# EAGLE design PetitCool_LedShield (EAGLE 7.3.0)
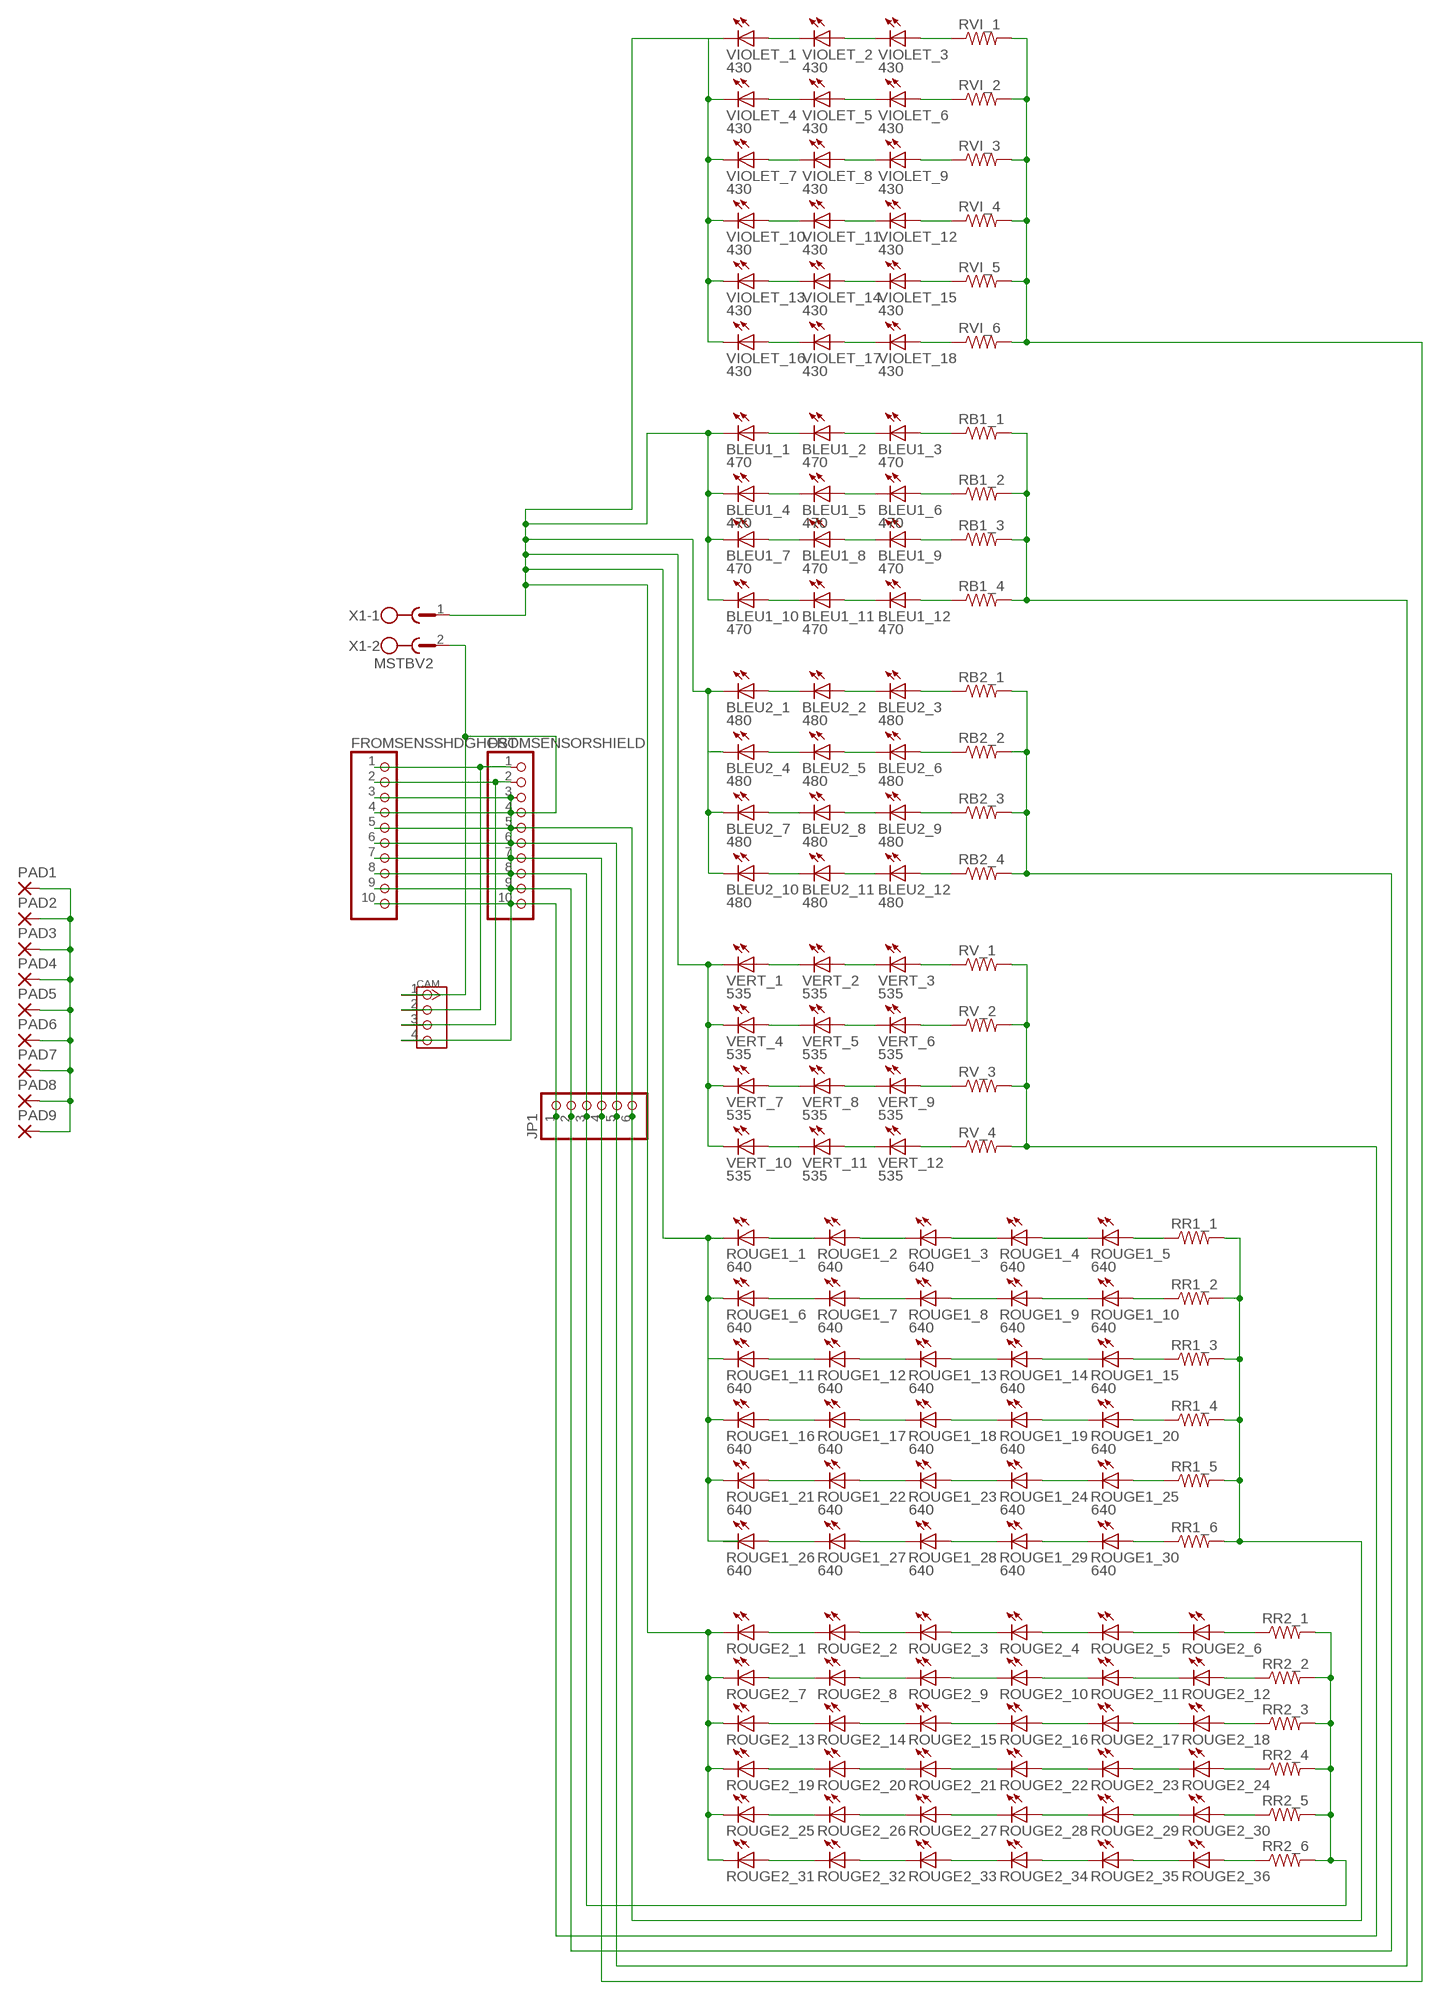
[diagram p0: schematic, sheet 1]

## Parts
BLEU1_1  470  LED5MM  [LED5MM]
BLEU1_2  470  LED5MM  [LED5MM]
BLEU1_3  470  LED5MM  [LED5MM]
BLEU1_4  470  LED5MM  [LED5MM]
BLEU1_5  470  LED5MM  [LED5MM]
BLEU1_6  470  LED5MM  [LED5MM]
BLEU1_7  470  LED5MM  [LED5MM]
BLEU1_8  470  LED5MM  [LED5MM]
BLEU1_9  470  LED5MM  [LED5MM]
BLEU1_10  470  LED5MM  [LED5MM]
BLEU1_11  470  LED5MM  [LED5MM]
BLEU1_12  470  LED5MM  [LED5MM]
BLEU2_1  480  LED5MM  [LED5MM]
BLEU2_2  480  LED5MM  [LED5MM]
BLEU2_3  480  LED5MM  [LED5MM]
BLEU2_4  480  LED5MM  [LED5MM]
BLEU2_5  480  LED5MM  [LED5MM]
BLEU2_6  480  LED5MM  [LED5MM]
BLEU2_7  480  LED5MM  [LED5MM]
BLEU2_8  480  LED5MM  [LED5MM]
BLEU2_9  480  LED5MM  [LED5MM]
BLEU2_10  480  LED5MM  [LED5MM]
BLEU2_11  480  LED5MM  [LED5MM]
BLEU2_12  480  LED5MM  [LED5MM]
CAM  TWIG-4P-2.0-2.0  [4P-2.0]
FROMSENSORSHIELD  PINHD-1X10  [1X10]
FROMSENSSHDGHOST  PINHD-1X10  [1X10]
JP1  PINHD-1X6  [1X06]
PAD1  2,15/1,0  [2,15/1,0]
PAD2  2,15/1,0  [2,15/1,0]
PAD3  2,15/1,0  [2,15/1,0]
PAD4  2,15/1,0  [2,15/1,0]
PAD5  2,15/1,0  [2,15/1,0]
PAD6  2,15/1,0  [2,15/1,0]
PAD7  2,15/1,0  [2,15/1,0]
PAD8  2,15/1,0  [2,15/1,0]
PAD9  2,15/1,0  [2,15/1,0]
RB1_1  R-US_0204/7  [0204/7]
RB1_2  R-US_0204/7  [0204/7]
RB1_3  R-US_0204/7  [0204/7]
RB1_4  R-US_0204/7  [0204/7]
RB2_1  R-US_0204/7  [0204/7]
RB2_2  R-US_0204/7  [0204/7]
RB2_3  R-US_0204/7  [0204/7]
RB2_4  R-US_0204/7  [0204/7]
ROUGE1_1  640  LED5MM  [LED5MM]
ROUGE1_2  640  LED5MM  [LED5MM]
ROUGE1_3  640  LED5MM  [LED5MM]
ROUGE1_4  640  LED5MM  [LED5MM]
ROUGE1_5  640  LED5MM  [LED5MM]
ROUGE1_6  640  LED5MM  [LED5MM]
ROUGE1_7  640  LED5MM  [LED5MM]
ROUGE1_8  640  LED5MM  [LED5MM]
ROUGE1_9  640  LED5MM  [LED5MM]
ROUGE1_10  640  LED5MM  [LED5MM]
ROUGE1_11  640  LED5MM  [LED5MM]
ROUGE1_12  640  LED5MM  [LED5MM]
ROUGE1_13  640  LED5MM  [LED5MM]
ROUGE1_14  640  LED5MM  [LED5MM]
ROUGE1_15  640  LED5MM  [LED5MM]
ROUGE1_16  640  LED5MM  [LED5MM]
ROUGE1_17  640  LED5MM  [LED5MM]
ROUGE1_18  640  LED5MM  [LED5MM]
ROUGE1_19  640  LED5MM  [LED5MM]
ROUGE1_20  640  LED5MM  [LED5MM]
ROUGE1_21  640  LED5MM  [LED5MM]
ROUGE1_22  640  LED5MM  [LED5MM]
ROUGE1_23  640  LED5MM  [LED5MM]
ROUGE1_24  640  LED5MM  [LED5MM]
ROUGE1_25  640  LED5MM  [LED5MM]
ROUGE1_26  640  LED5MM  [LED5MM]
ROUGE1_27  640  LED5MM  [LED5MM]
ROUGE1_28  640  LED5MM  [LED5MM]
ROUGE1_29  640  LED5MM  [LED5MM]
ROUGE1_30  640  LED5MM  [LED5MM]
ROUGE2_1  LED5MM  [LED5MM]
ROUGE2_2  LED5MM  [LED5MM]
ROUGE2_3  LED5MM  [LED5MM]
ROUGE2_4  LED5MM  [LED5MM]
ROUGE2_5  LED5MM  [LED5MM]
ROUGE2_6  LED5MM  [LED5MM]
ROUGE2_7  LED5MM  [LED5MM]
ROUGE2_8  LED5MM  [LED5MM]
ROUGE2_9  LED5MM  [LED5MM]
ROUGE2_10  LED5MM  [LED5MM]
ROUGE2_11  LED5MM  [LED5MM]
ROUGE2_12  LED5MM  [LED5MM]
ROUGE2_13  LED5MM  [LED5MM]
ROUGE2_14  LED5MM  [LED5MM]
ROUGE2_15  LED5MM  [LED5MM]
ROUGE2_16  LED5MM  [LED5MM]
ROUGE2_17  LED5MM  [LED5MM]
ROUGE2_18  LED5MM  [LED5MM]
ROUGE2_19  LED5MM  [LED5MM]
ROUGE2_20  LED5MM  [LED5MM]
ROUGE2_21  LED5MM  [LED5MM]
ROUGE2_22  LED5MM  [LED5MM]
ROUGE2_23  LED5MM  [LED5MM]
ROUGE2_24  LED5MM  [LED5MM]
ROUGE2_25  LED5MM  [LED5MM]
ROUGE2_26  LED5MM  [LED5MM]
ROUGE2_27  LED5MM  [LED5MM]
ROUGE2_28  LED5MM  [LED5MM]
ROUGE2_29  LED5MM  [LED5MM]
ROUGE2_30  LED5MM  [LED5MM]
ROUGE2_31  LED5MM  [LED5MM]
ROUGE2_32  LED5MM  [LED5MM]
ROUGE2_33  LED5MM  [LED5MM]
ROUGE2_34  LED5MM  [LED5MM]
ROUGE2_35  LED5MM  [LED5MM]
ROUGE2_36  LED5MM  [LED5MM]
RR1_1  R-US_0204/7  [0204/7]
RR1_2  R-US_0204/7  [0204/7]
RR1_3  R-US_0204/7  [0204/7]
RR1_4  R-US_0204/7  [0204/7]
RR1_5  R-US_0204/7  [0204/7]
RR1_6  R-US_0204/7  [0204/7]
RR2_1  R-US_0204/7  [0204/7]
RR2_2  R-US_0204/7  [0204/7]
RR2_3  R-US_0204/7  [0204/7]
RR2_4  R-US_0204/7  [0204/7]
RR2_5  R-US_0204/7  [0204/7]
RR2_6  R-US_0204/7  [0204/7]
RV_1  R-US_0204/7  [0204/7]
RV_2  R-US_0204/7  [0204/7]
RV_3  R-US_0204/7  [0204/7]
RV_4  R-US_0204/7  [0204/7]
RVI_1  R-US_0204/7  [0204/7]
RVI_2  R-US_0204/7  [0204/7]
RVI_3  R-US_0204/7  [0204/7]
RVI_4  R-US_0204/7  [0204/7]
RVI_5  R-US_0204/7  [0204/7]
RVI_6  R-US_0204/7  [0204/7]
VERT_1  535  LED5MM  [LED5MM]
VERT_2  535  LED5MM  [LED5MM]
VERT_3  535  LED5MM  [LED5MM]
VERT_4  535  LED5MM  [LED5MM]
VERT_5  535  LED5MM  [LED5MM]
VERT_6  535  LED5MM  [LED5MM]
VERT_7  535  LED5MM  [LED5MM]
VERT_8  535  LED5MM  [LED5MM]
VERT_9  535  LED5MM  [LED5MM]
VERT_10  535  LED5MM  [LED5MM]
VERT_11  535  LED5MM  [LED5MM]
VERT_12  535  LED5MM  [LED5MM]
VIOLET_1  430  LED5MM  [LED5MM]
VIOLET_2  430  LED5MM  [LED5MM]
VIOLET_3  430  LED5MM  [LED5MM]
VIOLET_4  430  LED5MM  [LED5MM]
VIOLET_5  430  LED5MM  [LED5MM]
VIOLET_6  430  LED5MM  [LED5MM]
VIOLET_7  430  LED5MM  [LED5MM]
VIOLET_8  430  LED5MM  [LED5MM]
VIOLET_9  430  LED5MM  [LED5MM]
VIOLET_10  430  LED5MM  [LED5MM]
VIOLET_11  430  LED5MM  [LED5MM]
VIOLET_12  430  LED5MM  [LED5MM]
VIOLET_13  430  LED5MM  [LED5MM]
VIOLET_14  430  LED5MM  [LED5MM]
VIOLET_15  430  LED5MM  [LED5MM]
VIOLET_16  430  LED5MM  [LED5MM]
VIOLET_17  430  LED5MM  [LED5MM]
VIOLET_18  430  LED5MM  [LED5MM]
X1  MSTBV2  [MSTBV2]

## Nets
+5V: CAM.2 FROMSENSORSHIELD.1 FROMSENSSHDGHOST.1
+12V: BLEU1_1.K(C) BLEU1_4.K(C) BLEU1_7.K(C) BLEU1_10.K(C) BLEU2_1.K(C) BLEU2_4.K(C) BLEU2_7.K(C) BLEU2_10.K(C) ROUGE1_1.K(C) ROUGE1_6.K(C) ROUGE1_11.K(C) ROUGE1_16.K(C) ROUGE1_21.K(C) ROUGE2_1.K(C) ROUGE2_7.K(C) ROUGE2_13.K(C) ROUGE2_19.K(C) ROUGE2_25.K(C) ROUGE2_31.K(C) VERT_1.K(C) VERT_4.K(C) VERT_7.K(C) VERT_10.K(C) VIOLET_1.K(C) VIOLET_4.K(C) VIOLET_7.K(C) VIOLET_10.K(C) VIOLET_13.K(C) VIOLET_16.K(C) X1.1
-LED1: FROMSENSORSHIELD.8 FROMSENSSHDGHOST.8 JP1.3 RR2_1.2 RR2_2.2 RR2_3.2 RR2_4.2 RR2_5.2 RR2_6.2
-LED2: FROMSENSORSHIELD.5 FROMSENSSHDGHOST.5 JP1.6 RR1_1.2 RR1_2.2 RR1_3.2 RR1_4.2 RR1_5.2 RR1_6.2
-LED3: FROMSENSORSHIELD.10 FROMSENSSHDGHOST.10 JP1.1 RV_1.2 RV_2.2 RV_3.2 RV_4.2
-LED4: FROMSENSORSHIELD.9 FROMSENSSHDGHOST.9 JP1.2 RB2_1.2 RB2_2.2 RB2_3.2 RB2_4.2
-LED5: FROMSENSORSHIELD.6 FROMSENSSHDGHOST.6 JP1.5 RB1_1.2 RB1_2.2 RB1_3.2 RB1_4.2
-LED6: FROMSENSORSHIELD.7 FROMSENSSHDGHOST.7 JP1.4 RVI_1.2 RVI_2.2 RVI_3.2 RVI_4.2 RVI_5.2 RVI_6.2
CAM_RX: CAM.3 FROMSENSORSHIELD.2 FROMSENSSHDGHOST.2
CAM_TX: CAM.4 FROMSENSORSHIELD.3 FROMSENSSHDGHOST.3
GND_12V: CAM.1 FROMSENSORSHIELD.4 FROMSENSSHDGHOST.4 PAD1.1(P) PAD2.1(P) PAD3.1(P) PAD4.1(P) PAD5.1(P) PAD6.1(P) PAD7.1(P) PAD8.1(P) PAD9.1(P) X1.2
N$12: ROUGE2_1.A ROUGE2_2.K(C)
N$13: ROUGE2_2.A ROUGE2_3.K(C)
N$14: ROUGE2_3.A ROUGE2_4.K(C)
N$15: ROUGE2_4.A ROUGE2_5.K(C)
N$16: ROUGE2_5.A ROUGE2_6.K(C)
N$17: ROUGE2_6.A RR2_1.1
N$18: ROUGE2_7.A ROUGE2_8.K(C)
N$19: ROUGE2_8.A ROUGE2_9.K(C)
N$20: ROUGE2_9.A ROUGE2_10.K(C)
N$21: ROUGE2_10.A ROUGE2_11.K(C)
N$22: ROUGE2_11.A ROUGE2_12.K(C)
N$23: ROUGE2_12.A RR2_2.1
N$24: ROUGE2_13.A ROUGE2_14.K(C)
N$25: ROUGE2_14.A ROUGE2_15.K(C)
N$26: ROUGE2_15.A ROUGE2_16.K(C)
N$27: ROUGE2_16.A ROUGE2_17.K(C)
N$28: ROUGE2_17.A ROUGE2_18.K(C)
N$29: ROUGE2_18.A RR2_3.1
N$30: ROUGE2_19.A ROUGE2_20.K(C)
N$31: ROUGE2_20.A ROUGE2_21.K(C)
N$32: ROUGE2_21.A ROUGE2_22.K(C)
N$33: ROUGE2_22.A ROUGE2_23.K(C)
N$34: ROUGE2_23.A ROUGE2_24.K(C)
N$35: ROUGE2_24.A RR2_4.1
N$36: ROUGE2_25.A ROUGE2_26.K(C)
N$37: ROUGE2_26.A ROUGE2_27.K(C)
N$38: ROUGE2_27.A ROUGE2_28.K(C)
N$39: ROUGE2_28.A ROUGE2_29.K(C)
N$40: ROUGE2_29.A ROUGE2_30.K(C)
N$41: ROUGE2_30.A RR2_5.1
N$42: ROUGE2_31.A ROUGE2_32.K(C)
N$43: ROUGE2_32.A ROUGE2_33.K(C)
N$44: ROUGE2_33.A ROUGE2_34.K(C)
N$45: ROUGE2_34.A ROUGE2_35.K(C)
N$46: ROUGE2_35.A ROUGE2_36.K(C)
N$47: ROUGE2_36.A RR2_6.1
N$48: ROUGE1_26.A ROUGE1_27.K(C)
N$49: ROUGE1_27.A ROUGE1_28.K(C)
N$50: ROUGE1_28.A ROUGE1_29.K(C)
N$51: ROUGE1_29.A ROUGE1_30.K(C)
N$52: ROUGE1_30.A RR1_6.1
N$53: ROUGE1_21.A ROUGE1_22.K(C)
N$54: ROUGE1_22.A ROUGE1_23.K(C)
N$55: ROUGE1_23.A ROUGE1_24.K(C)
N$56: ROUGE1_24.A ROUGE1_25.K(C)
N$57: ROUGE1_25.A RR1_5.1
N$58: ROUGE1_16.A ROUGE1_17.K(C)
N$59: ROUGE1_17.A ROUGE1_18.K(C)
N$60: ROUGE1_18.A ROUGE1_19.K(C)
N$61: ROUGE1_19.A ROUGE1_20.K(C)
N$62: ROUGE1_20.A RR1_4.1
N$63: ROUGE1_11.A ROUGE1_12.K(C)
N$64: ROUGE1_12.A ROUGE1_13.K(C)
N$65: ROUGE1_13.A ROUGE1_14.K(C)
N$66: ROUGE1_14.A ROUGE1_15.K(C)
N$67: ROUGE1_15.A RR1_3.1
N$68: ROUGE1_6.A ROUGE1_7.K(C)
N$69: ROUGE1_7.A ROUGE1_8.K(C)
N$70: ROUGE1_8.A ROUGE1_9.K(C)
N$71: ROUGE1_9.A ROUGE1_10.K(C)
N$72: ROUGE1_10.A RR1_2.1
N$73: ROUGE1_1.A ROUGE1_2.K(C)
N$74: ROUGE1_2.A ROUGE1_3.K(C)
N$75: ROUGE1_3.A ROUGE1_4.K(C)
N$76: ROUGE1_4.A ROUGE1_5.K(C)
N$77: ROUGE1_5.A RR1_1.1
N$78: VERT_10.A VERT_11.K(C)
N$79: VERT_11.A VERT_12.K(C)
N$80: RV_4.1 VERT_12.A
N$81: VERT_7.A VERT_8.K(C)
N$82: VERT_8.A VERT_9.K(C)
N$83: RV_3.1 VERT_9.A
N$84: VERT_4.A VERT_5.K(C)
N$85: VERT_5.A VERT_6.K(C)
N$86: RV_2.1 VERT_6.A
N$87: VERT_1.A VERT_2.K(C)
N$88: VERT_2.A VERT_3.K(C)
N$89: RV_1.1 VERT_3.A
N$90: BLEU2_10.A BLEU2_11.K(C)
N$91: BLEU2_11.A BLEU2_12.K(C)
N$92: BLEU2_12.A RB2_4.1
N$93: BLEU2_7.A BLEU2_8.K(C)
N$94: BLEU2_8.A BLEU2_9.K(C)
N$95: BLEU2_9.A RB2_3.1
N$96: BLEU2_4.A BLEU2_5.K(C)
N$97: BLEU2_5.A BLEU2_6.K(C)
N$98: BLEU2_6.A RB2_2.1
N$99: BLEU2_1.A BLEU2_2.K(C)
N$100: BLEU2_2.A BLEU2_3.K(C)
N$101: BLEU2_3.A RB2_1.1
N$102: BLEU1_10.A BLEU1_11.K(C)
N$103: BLEU1_11.A BLEU1_12.K(C)
N$104: BLEU1_12.A RB1_4.1
N$105: BLEU1_7.A BLEU1_8.K(C)
N$106: BLEU1_8.A BLEU1_9.K(C)
N$107: BLEU1_9.A RB1_3.1
N$108: BLEU1_4.A BLEU1_5.K(C)
N$109: BLEU1_5.A BLEU1_6.K(C)
N$110: BLEU1_6.A RB1_2.1
N$111: BLEU1_1.A BLEU1_2.K(C)
N$112: BLEU1_2.A BLEU1_3.K(C)
N$113: BLEU1_3.A RB1_1.1
N$114: VIOLET_16.A VIOLET_17.K(C)
N$115: VIOLET_17.A VIOLET_18.K(C)
N$116: RVI_6.1 VIOLET_18.A
N$117: VIOLET_13.A VIOLET_14.K(C)
N$118: VIOLET_14.A VIOLET_15.K(C)
N$119: RVI_5.1 VIOLET_15.A
N$120: VIOLET_10.A VIOLET_11.K(C)
N$121: VIOLET_11.A VIOLET_12.K(C)
N$122: RVI_4.1 VIOLET_12.A
N$123: VIOLET_7.A VIOLET_8.K(C)
N$124: VIOLET_8.A VIOLET_9.K(C)
N$125: RVI_3.1 VIOLET_9.A
N$126: VIOLET_4.A VIOLET_5.K(C)
N$127: VIOLET_5.A VIOLET_6.K(C)
N$128: RVI_2.1 VIOLET_6.A
N$129: VIOLET_1.A VIOLET_2.K(C)
N$130: VIOLET_2.A VIOLET_3.K(C)
N$131: RVI_1.1 VIOLET_3.A
Unconnected: ROUGE1_26.K(C)

## Library data of the parts
BLEU1_1-BLEU1_12 BLEU2_1-BLEU2_12 ROUGE1_1-ROUGE1_30 ROUGE2_1-ROUGE2_36 VERT_1-VERT_12 VIOLET_1-VIOLET_18 = led:LED: LED OSRAM: - CHIPLED LG R971, LG N971, LY N971, LG Q971, LY Q971, LO R971, LY R971 LH N974, LH R974 LS Q976, LO Q976, LY Q976 LO Q996 - Hyper CHIPLED LW Q18S LB Q993, LB Q99A, LB R99A - SideLED LS A670, LO A670, LY A670, LG A670, LP A670 LB A673, LV A673, LT A673, LW A673 LH A674 LY A675 LS A676, LA A676, LO A676, LY A676, LW A676 LS A679, LY A679, LG A679 - Hyper Micro SIDELED® LS Y876, LA Y876, LO Y876, LY Y876 LT Y87S - SmartLED LW L88C, LW L88S LB L89C, LB L89S, LG L890 LS L89K, LO L89K, LY L89K LS L896, LA L896, LO L896, LY L896 - TOPLED LS T670, LO T670, LY T670, LG T670, LP T670 LSG T670, LSP T670, LSY T670, LOP T670, LYG T670 LG T671, LOG T671, LSG T671 LB T673, LV T673, LT T673, LW T673 LH T674 LS T676, LA T676, LO T676, LY T676, LB T676, LH T676, LSB T676, LW T676 LB T67C, LV T67C, LT T67C, LS T67K, LO T67K, LY T67K, LW E67C LS E67B, LA E67B, LO E67B, LY E67B, LB E67C, LV E67C, LT E67C LW T67C LS T679, LY T679, LG T679 LS T770, LO T770, LY T770, LG T770, LP T770 LB T773, LV T773, LT T773, LW T773 LH T774 LS E675, LA E675, LY E675, LS T675 LS T776, LA T776, LO T776, LY T776, LB T776 LHGB T686 LT T68C, LB T68C - Hyper Mini TOPLED® LB M676 - Mini TOPLED Santana® LG M470 LS M47K, LO M47K, LY M47K Source: http://www.osram.convergy.de LUXEON: - LUMILED® LXK2-PW12-R00, LXK2-PW12-S00, LXK2-PW14-U00, LXK2-PW14-V00 LXK2-PM12-R00, LXK2-PM12-S00, LXK2-PM14-U00 LXK2-PE12-Q00, LXK2-PE12-R00, LXK2-PE12-S00, LXK2-PE14-T00, LXK2-PE14-U00 LXK2-PB12-K00, LXK2-PB12-L00, LXK2-PB12-M00, LXK2-PB14-N00, LXK2-PB14-P00, LXK2-PB14-Q00 LXK2-PR12-L00, LXK2-PR12-M00, LXK2-PR14-Q00, LXK2-PR14-R00 LXK2-PD12-Q00, LXK2-PD12-R00, LXK2-PD12-S00 LXK2-PH12-R00, LXK2-PH12-S00 LXK2-PL12-P00, LXK2-PL12-Q00, LXK2-PL12-R00 Source: www.luxeon.com KINGBRIGHT: KA-3528ASYC Source: www.kingbright.com
CAM = Connector:TWIG-4P-2.0
FROMSENSORSHIELD FROMSENSSHDGHOST = pinhead:PINHD-1X10: PIN HEADER
JP1 = pinhead:PINHD-1X6: PIN HEADER
PAD1-PAD9 = wirepad:2,15/1,0: THROUGH-HOLE PAD
RB1_1-RB1_4 RB2_1-RB2_4 RR1_1-RR1_6 RR2_1-RR2_6 RV_1-RV_4 RVI_1-RVI_6 = rcl:R-US_: RESISTOR, American symbol
X1 = con-phoenix-508:MSTBV2: PHOENIX; MPN: MSTBV 2,5/2-GF-5.08; OC_FARNELL: 1792792; OC_NEWARK: 69R9845

## Board
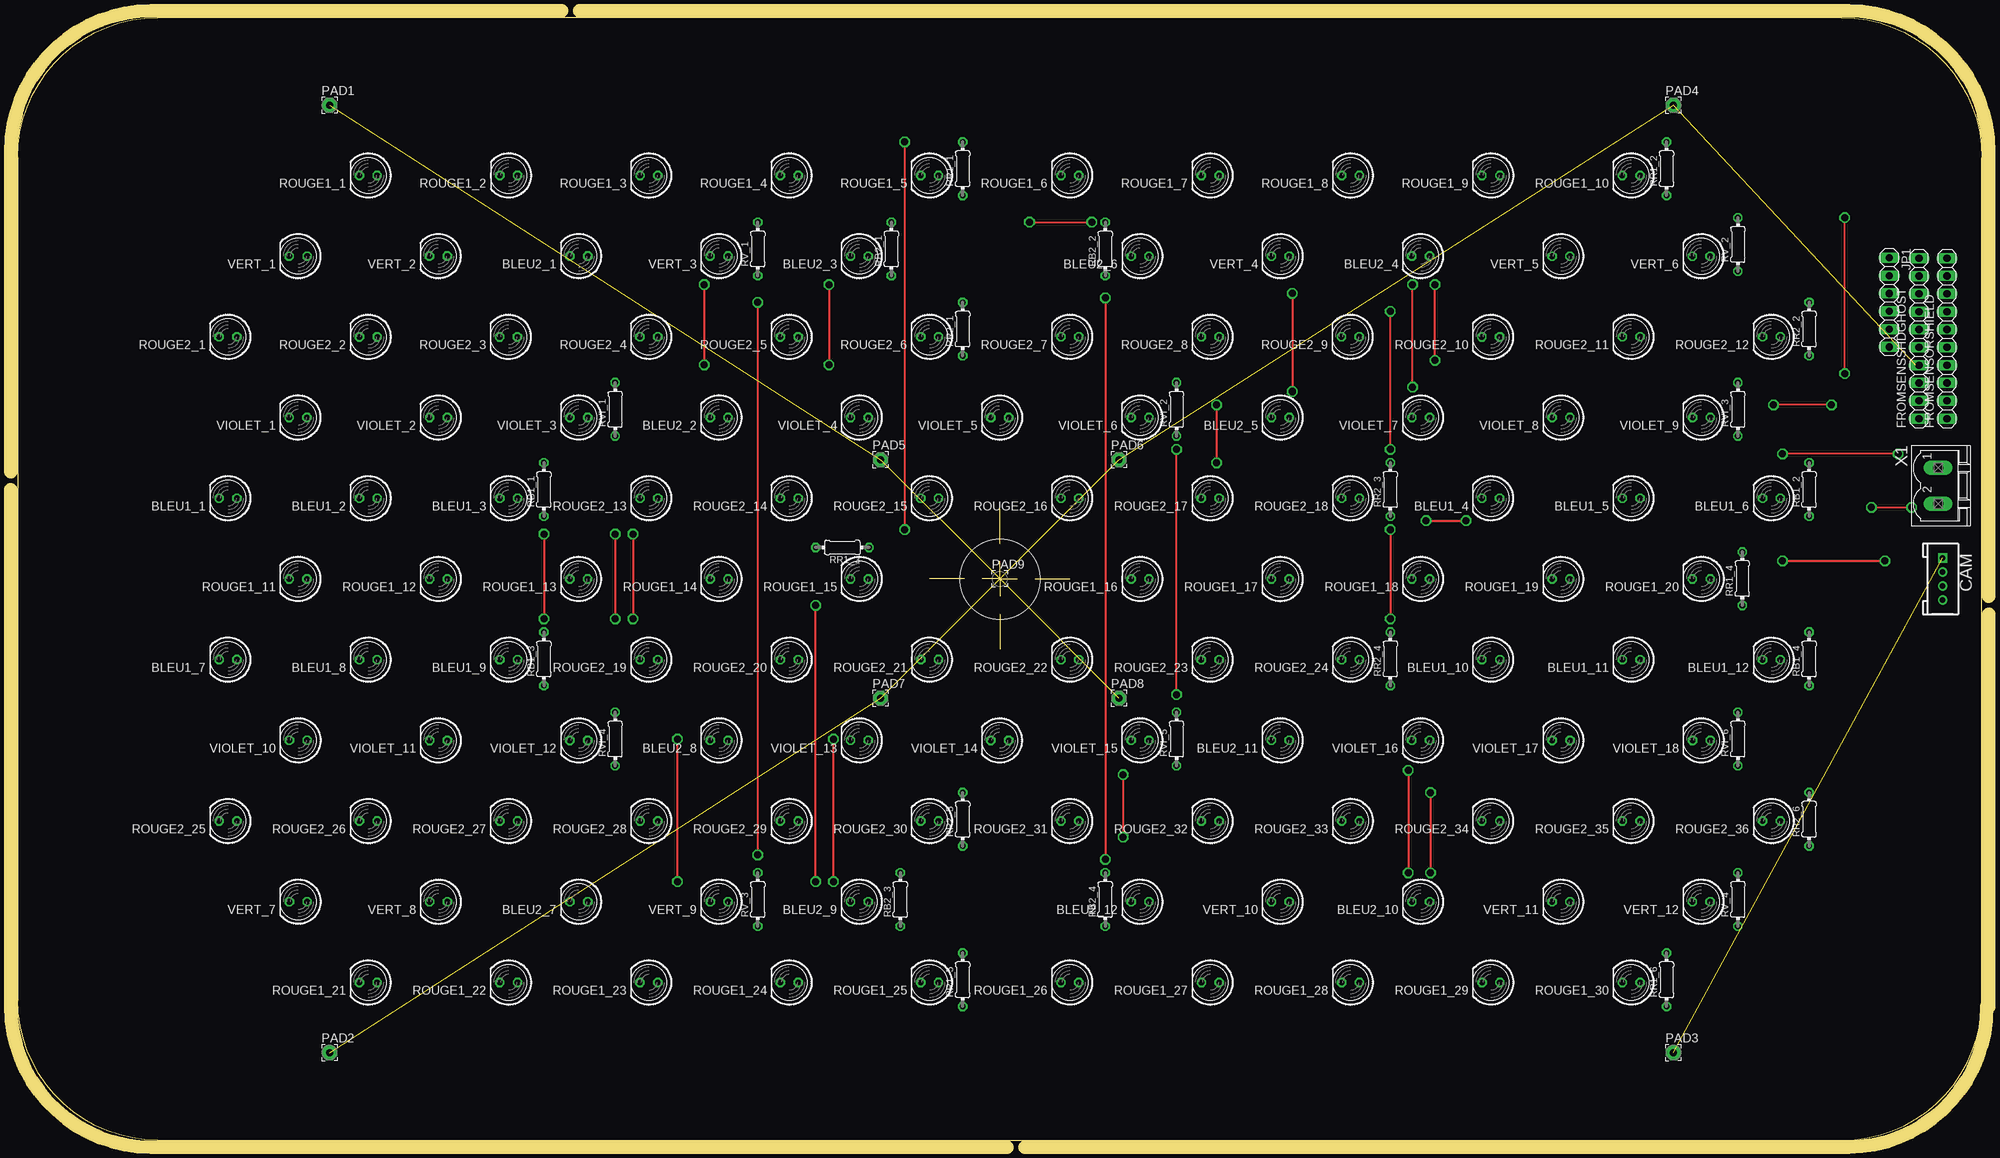
[diagram p1: board, top side]
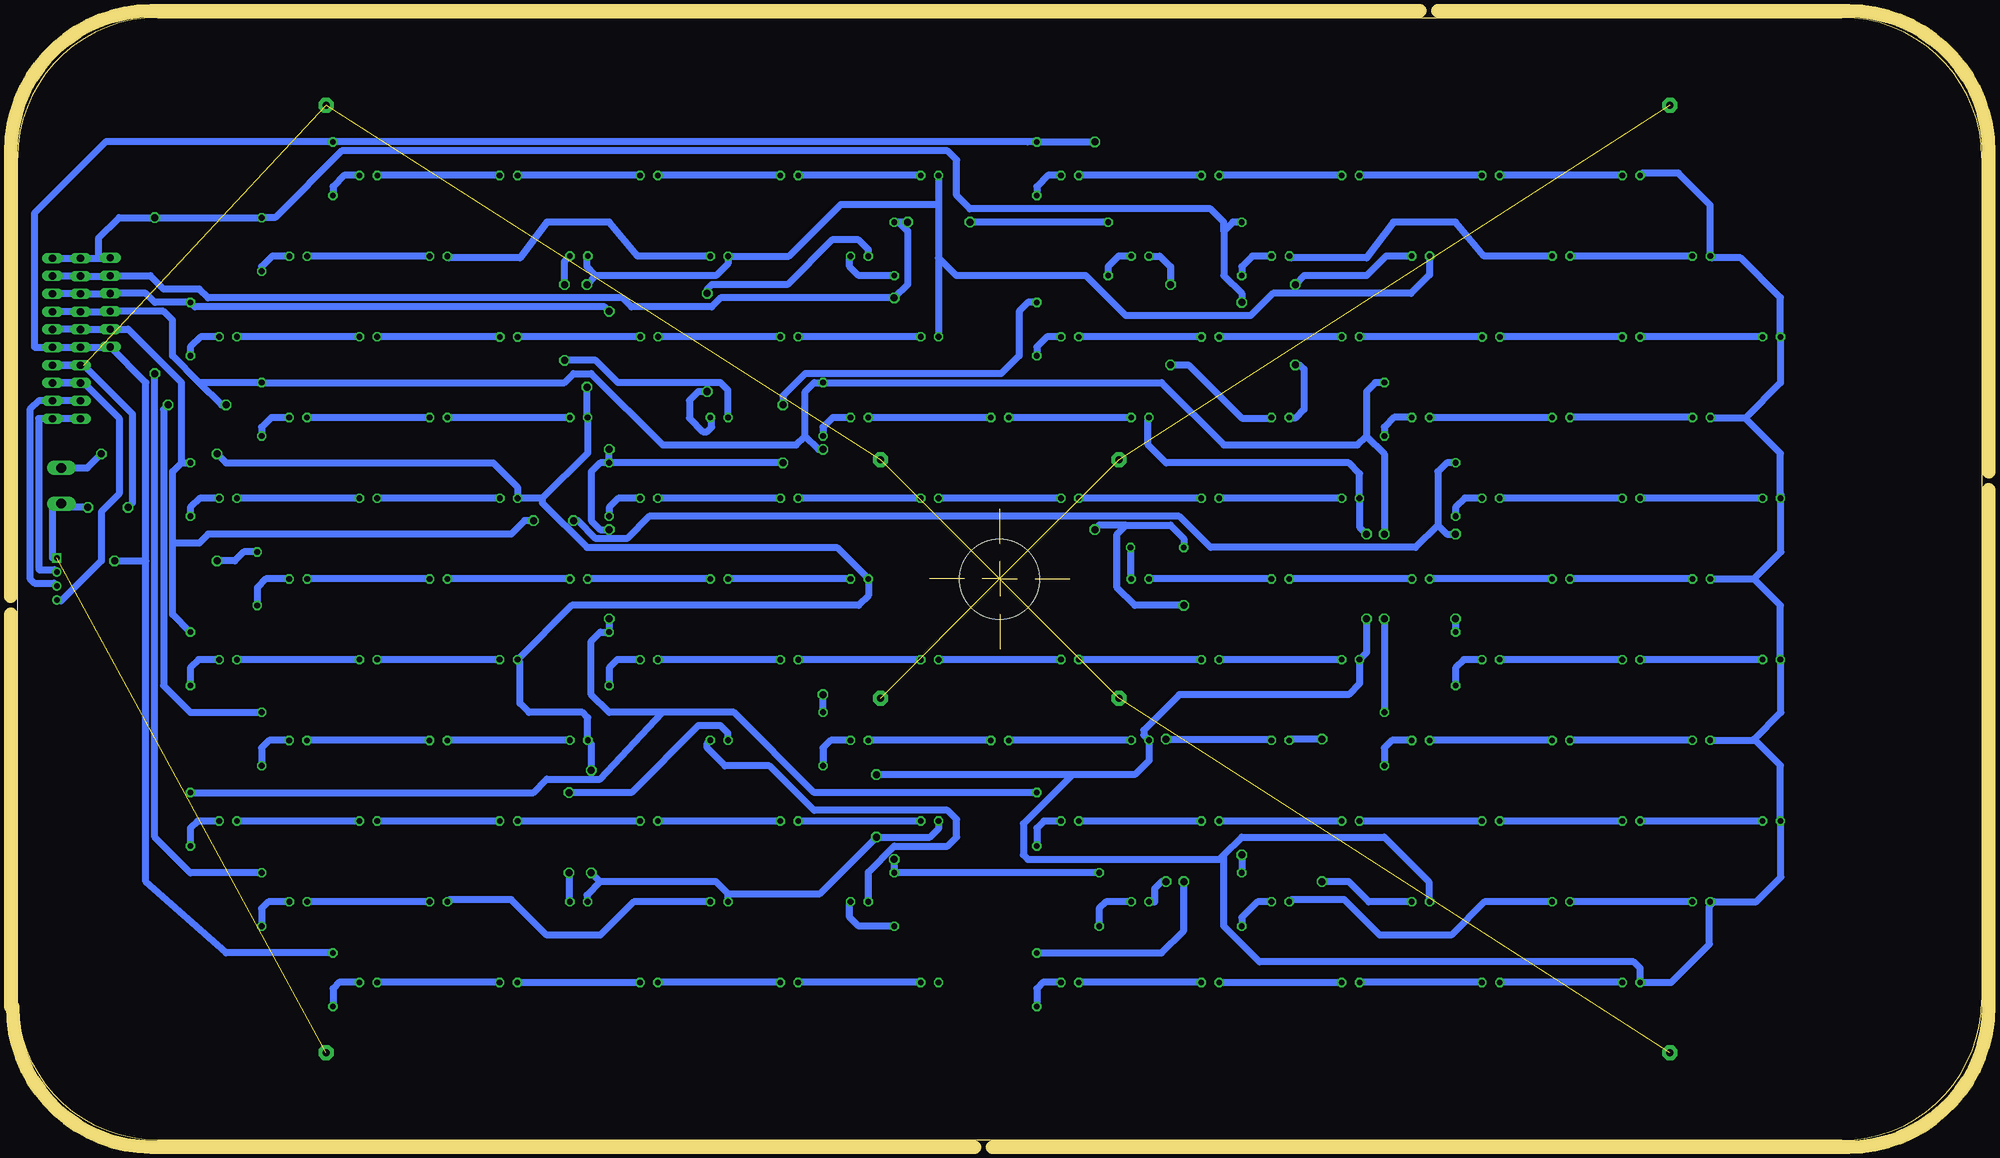
[diagram p2: board, bottom side, seen from below]

Size 280 x 160 mm. Coordinates in mm from the lower left corner, seen from the top.
Outline: 0,20 0,140 arc-90 20,160 260,160 arc-90 280,140 280,20 arc-90 260,0 20,0 arc-90 0.05,20
Outline: 140,80 140,82.5
Outline: 140,80 137.5,80
Outline: 140,80 140,77.5
Outline: 140,80 142.5,80
Outline: 140,85 140,90
Outline: 135,80 130,80
Outline: 140,75 140,70
Outline: 145,80 150,80
Copper layers (1*16): Top 0.035mm / dielectric 1.5mm / Bottom 0.035mm
Design rules "default": minimum track width 10mil, minimum drill 24mil, track to track 8mil, track to pad 8mil, pad to pad 8mil, via to via 8mil, smd to smd 8mil, copper to edge 40mil, drill to drill 8mil, minimum pad ring 10mil, minimum via ring 8mil, stop-mask expansion 4mil, vias tented up to drill 0mil, thermal gap 10mil
Holes 11.43 mm at 140,79.99
Milling: 12 lines

### Footprints (pad centres in the part's own frame; a part is rotated, then mirrored left to right if it is on the bottom)
LED5MM = drill 0.813 octagon: A -1.27,0; K 1.27,0
4P-2.0 = drill 0.8 pad 1.27 square: 1 -3,0 | drill 0.8 pad 1.27: 2 -1,0; 3 1,0; 4 3,0
1X10 = drill 1.016 long: 1 -11.43,0; 2 -8.89,0; 3 -6.35,0; 4 -3.81,0; 5 -1.27,0; 6 1.27,0; 7 3.81,0; 8 6.35,0; 9 8.89,0; 10 11.43,0
1X06 = drill 1.016 long: 1 -6.35,0; 2 -3.81,0; 3 -1.27,0; 4 1.27,0; 5 3.81,0; 6 6.35,0
2,15/1,0 = drill 1.016 pad 2.159 octagon: 1 0,0
0204/7 = drill 0.813 octagon: 1 -3.81,0; 2 3.81,0
MSTBV2 = drill 1.397 long: 1 -2.54,0; 2 2.54,0

### Placement (x,y rotation side)
BLEU1_1  30,91.5 180 top
BLEU1_2  50,91.5 180 top
BLEU1_3  70,91.5 180 top
BLEU1_4  209.99,91.5 180 top
BLEU1_5  230,91.5 180 top
BLEU1_6  250,91.5 180 top
BLEU1_7  30,68.5 180 top
BLEU1_8  50,68.5 180 top
BLEU1_9  70,68.5 180 top
BLEU1_10  210,68.5 180 top
BLEU1_11  230,68.5 180 top
BLEU1_12  250,68.49 180 top
BLEU2_1  80,126.01 180 top
BLEU2_2  100,103 180 top
BLEU2_3  120,126 180 top
BLEU2_4  200,126 180 top
BLEU2_5  180,103 180 top
BLEU2_6  160,125.99 180 top
BLEU2_7  80,34 180 top
BLEU2_8  100,57 180 top
BLEU2_9  120,34 180 top
BLEU2_10  200,34 180 top
BLEU2_11  180,57 180 top
BLEU2_12  160.01,34 180 top
CAM  274.39,79.99 270 top
FROMSENSORSHIELD  275.03,114.28 90 top
FROMSENSSHDGHOST  271.03,114.28 90 top
JP1  266.8,119.41 270 top
PAD1  44.47,147.5 0 top
PAD2  44.47,12.5 0 top
PAD3  236.03,12.5 0 top
PAD4  236.03,147.5 0 top
PAD5  123,97 0 top
PAD6  157,97 0 top
PAD7  123,63 0 top
PAD8  157,63 0 top
PAD9  140,80 0 top
RB1_1  75.03,92.74 90 top
RB1_2  255.37,92.74 90 top
RB1_3  75.03,68.61 90 top
RB1_4  255.37,68.61 90 top
RB2_1  124.56,127.03 90 top
RB2_2  155.04,127.03 90 top
RB2_3  125.83,34.32 90 top
RB2_4  155.04,34.32 90 top
ROUGE1_1  50,137.5 180 top
ROUGE1_2  70.01,137.51 180 top
ROUGE1_3  90,137.49 180 top
ROUGE1_4  110,137.5 180 top
ROUGE1_5  130,137.5 180 top
ROUGE1_6  150,137.5 180 top
ROUGE1_7  170,137.5 180 top
ROUGE1_8  190.01,137.49 180 top
ROUGE1_9  210,137.5 180 top
ROUGE1_10  230,137.5 180 top
ROUGE1_11  39.99,80 180 top
ROUGE1_12  60,80 180 top
ROUGE1_13  79.99,80 180 top
ROUGE1_14  100,80 180 top
ROUGE1_15  120,80 180 top
ROUGE1_16  160,80 180 top
ROUGE1_17  179.99,79.99 180 top
ROUGE1_18  200.01,80 180 top
ROUGE1_19  220,80 180 top
ROUGE1_20  240,80 180 top
ROUGE1_21  50,22.49 180 top
ROUGE1_22  70,22.5 180 top
ROUGE1_23  89.98,22.49 180 top
ROUGE1_24  110,22.5 180 top
ROUGE1_25  130,22.5 180 top
ROUGE1_26  150.01,22.5 180 top
ROUGE1_27  170.01,22.5 180 top
ROUGE1_28  190,22.49 180 top
ROUGE1_29  210.01,22.5 180 top
ROUGE1_30  230.01,22.5 180 top
ROUGE2_1  29.99,114.5 180 top
ROUGE2_2  50,114.5 180 top
ROUGE2_3  69.98,114.5 180 top
ROUGE2_4  89.99,114.5 180 top
ROUGE2_5  110,114.49 180 top
ROUGE2_6  129.99,114.5 180 top
ROUGE2_7  150.01,114.5 180 top
ROUGE2_8  170,114.5 180 top
ROUGE2_9  189.98,114.51 180 top
ROUGE2_10  210,114.49 180 top
ROUGE2_11  230,114.5 180 top
ROUGE2_12  250,114.5 180 top
ROUGE2_13  90,91.5 180 top
ROUGE2_14  110,91.5 180 top
ROUGE2_15  130,91.5 180 top
ROUGE2_16  150,91.5 180 top
ROUGE2_17  170,91.5 180 top
ROUGE2_18  190,91.5 180 top
ROUGE2_19  90,68.5 180 top
ROUGE2_20  110,68.5 180 top
ROUGE2_21  130,68.5 180 top
ROUGE2_22  150,68.5 180 top
ROUGE2_23  170,68.49 180 top
ROUGE2_24  190,68.5 180 top
ROUGE2_25  30,45.5 180 top
ROUGE2_26  50,45.5 180 top
ROUGE2_27  70,45.5 180 top
ROUGE2_28  90,45.5 180 top
ROUGE2_29  110,45.5 180 top
ROUGE2_30  130,45.5 180 top
ROUGE2_31  150,45.5 180 top
ROUGE2_32  170,45.49 180 top
ROUGE2_33  190,45.5 180 top
ROUGE2_34  210,45.5 180 top
ROUGE2_35  230,45.5 180 top
ROUGE2_36  250,45.5 180 top
RR1_1  134.72,138.46 90 top
RR1_2  235.05,138.46 90 top
RR1_3  117.57,84.49 180 top
RR1_4  245.84,80.04 90 top
RR1_5  134.72,22.89 90 top
RR1_6  235.05,22.89 90 top
RR2_1  134.72,115.6 90 top
RR2_2  255.37,115.6 90 top
RR2_3  195.68,92.74 90 top
RR2_4  195.68,68.61 90 top
RR2_5  134.72,45.75 90 top
RR2_6  255.37,45.75 90 top
RV_1  105.51,127.03 90 top
RV_2  245.21,127.67 90 top
RV_3  105.51,34.32 90 top
RV_4  245.21,34.32 90 top
RVI_1  85.19,104.17 90 top
RVI_2  165.2,104.17 90 top
RVI_3  245.21,104.17 90 top
RVI_4  85.19,57.18 90 top
RVI_5  165.2,57.18 90 top
RVI_6  245.21,57.18 90 top
VERT_1  40,126 180 top
VERT_2  59.98,126 180 top
VERT_3  99.99,126 180 top
VERT_4  180,126 180 top
VERT_5  220,126 180 top
VERT_6  239.99,126 180 top
VERT_7  40.01,34.01 180 top
VERT_8  60,33.99 180 top
VERT_9  100,34 180 top
VERT_10  180,34 180 top
VERT_11  220,34 180 top
VERT_12  239.99,34 180 top
VIOLET_1  39.99,103.01 180 top
VIOLET_2  59.99,103 180 top
VIOLET_3  80,103.01 180 top
VIOLET_4  120.01,103 180 top
VIOLET_5  140,102.99 180 top
VIOLET_6  159.99,103 180 top
VIOLET_7  200,103 180 top
VIOLET_8  220,103 180 top
VIOLET_9  240.01,103 180 top
VIOLET_10  40.01,57 180 top
VIOLET_11  60,57 180 top
VIOLET_12  80,56.99 180 top
VIOLET_13  120,57 180 top
VIOLET_14  140,56.99 180 top
VIOLET_15  160,57 180 top
VIOLET_16  200,57 180 top
VIOLET_17  220.01,57 180 top
VIOLET_18  240,57 180 top
X1  273.75,93.28 270 top

### Tracks (layer width: path | path; a pad name or v marks a point on that pad's centre or on a via)
+5V
  Bottom 1.016: FROMSENSSHDGHOST.1 FROMSENSORSHIELD.1 277.01,102.85 276.96,101.63 276.96,81.31 274.71,81.31 CAM.2
+12V  (via drill 1)
  Top 0.254: v87.73,86.39 v87.73,74.33 | v198.85,107.35 v198.85,121.95 | v198.22,52.74 v198.22,38.13 | v157.58,52.1 v157.58,43.21 | v268.07,97.82 v251.56,97.82
  Bottom 1.016: ROUGE1_1.K 48.4,137.83 43.28,137.83 38.73,133.28 VERT_1.K 38.49,125.76 34.39,125.76 28.72,120.1 ROUGE2_1.K 28.72,107.93 33.75,102.9 | 33.75,102.9 38.62,102.9 VIOLET_1.K | BLEU1_1.K 28.73,92.11 | 28.73,92.11 28.73,97.88 33.75,102.9 | ROUGE1_11.K 32.52,80 | 32.52,80 28.67,83.85 28.67,92.05 28.73,92.11 | 32.52,80 28.73,76.22 BLEU1_7.K 28.67,68.44 28.67,60.99 32.48,57.18 | VIOLET_10.K 32.66,57 32.48,57.18 | 32.48,57.18 28.73,53.43 ROUGE2_25.K 28.67,45.44 28.67,37.5 32.16,34.01 38.2,34.01 | VERT_7.K 38.2,34.01 | 38.2,34.01 38.83,33.38 38.83,27.97 44.31,22.49 ROUGE1_21.K 48.73,24.53 49.63,25.43 102.97,25.43 108.05,30.51 108.05,40.67 | VIOLET_4.K 118.84,102.9 118.84,99.09 116.3,96.55 90.27,96.55 88.73,95.01 ROUGE2_13.K 88.73,87.39 v87.73,86.39 | ROUGE1_6.K 148.73,133.38 | 148.73,133.38 148.73,125.76 | 148.73,125.76 ROUGE2_7.K | 148.73,133.38 162.66,133.38 170.04,126 VERT_4.K 178.73,124.93 180.44,123.22 197.58,123.22 | 205.2,91.47 198.73,97.94 VIOLET_7.K 198.85,103.12 v198.85,107.35 | 205.2,91.47 208.7,91.47 BLEU1_4.K 208.72,93.09 212.19,96.55 250.29,96.55 v251.56,97.82 | 197.58,123.22 198.85,124.49 198.85,125.88 BLEU2_4.K | v87.73,74.33 87.73,69.5 ROUGE2_19.K 88.73,65.07 90.27,63.53 114.4,63.53 119.48,58.45 119.48,57.75 VIOLET_13.K 118.73,54.12 120.75,52.1 129.64,52.1 | v198.85,121.95 197.58,123.22 | VERT_10.K 178.73,35.15 | 178.73,35.15 180.44,36.86 196.95,36.86 | 196.95,36.86 198.85,34.96 198.85,34.12 BLEU2_10.K | v198.22,52.74 198.22,56.49 VIOLET_16.K 198.73,60.23 199.49,60.99 207.11,60.99 208.38,62.26 208.38,68.15 BLEU1_10.K 201,76.23 160.12,76.23 158.73,77.62 ROUGE1_16.K 163.21,84.49 198.85,84.49 205.2,90.84 205.2,91.47
  Bottom 1.016: v198.22,38.13 196.95,36.86 | 129.64,52.1 v157.58,52.1 | ROUGE2_31.K 148.69,45.46 148.69,44.48 149.96,43.21 v157.58,43.21 165.64,35.15 178.73,35.15 | 108.05,40.67 105.51,43.21 85.19,43.21 78.84,36.86 78.84,34.1 BLEU2_7.K | 129.64,52.1 136.62,45.12 136.62,40.67 135.99,40.04 108.68,40.04 108.05,40.67 | BLEU2_1.K 78.73,123.33 81.38,120.68 101.06,120.68 104.24,117.51 122.02,117.51 127.73,123.22 146.19,123.22 148.73,125.76 | v268.07,97.82 270.06,95.82 X1.1
-LED1  (via drill 1)
  Top 0.254: v195.68,87.03 v195.68,74.33 | v170.91,104.81 v170.91,96.55 | v195.68,98.46 v195.68,118.14
  Bottom 1.016: RR2_3.2 196.95,96.55 198.22,95.28 198.22,88.3 196.95,87.03 v195.68,87.03 | v195.68,74.33 RR2_4.2 196.95,72.42 198.22,71.15 198.22,63.53 195.68,60.99 188.06,60.99 | RR2_5.2 166.47,49.56 177.9,60.99 188.06,60.99 | RR2_6.2 206.47,49.56 204.57,51.47 196.95,51.47 188.06,60.99 | RR2_1.2 135.99,119.41 137.26,118.14 137.26,111.79 139.8,109.25 167.74,109.25 170.91,106.08 v170.91,104.81 | v170.91,96.55 RR2_3.2 | RR2_3.2 v195.68,98.46 | v195.68,118.14 196.31,118.78 254.73,118.78 RR2_2.2 260.45,119.41 261.72,120.68 JP1.3 266.85,120.63 FROMSENSSHDGHOST.8 | FROMSENSSHDGHOST.8 | FROMSENSSHDGHOST.8 FROMSENSORSHIELD.8
-LED2  (via drill 1)
  Top 0.254: v113.76,36.86 v113.76,76.23 | v126.46,142.27 v126.46,87.03 | v251.56,82.58 v266.16,82.58
  Bottom 1.016: RR1_1.2 RR1_2.2 267.43,142.27 277.59,132.11 277.59,113.04 FROMSENSORSHIELD.5 FROMSENSSHDGHOST.5 266.85,113.01 JP1.6 261.72,107.98 261.72,82.58 | RR1_5.2 116.94,26.7 113.76,29.88 v113.76,36.86 | v113.76,76.23 120.75,76.23 123.29,78.77 123.29,86.39 122.02,87.66 | 122.02,87.66 115.67,87.66 113.76,85.76 RR1_3.2 | RR1_1.2 135.99,142.27 | RR1_1.2 v126.46,142.27 | 122.02,87.66 125.83,87.66 v126.46,87.03 | RR1_6.2 250.29,26.7 261.72,36.86 261.72,82.58 | RR1_4.2 247.75,83.85 249.02,82.58 v251.56,82.58 | v266.16,82.58 261.72,82.58
-LED3  (via drill 1)
  Top 0.254: v105.51,119.41 v105.51,40.67 | v260.45,109.25 v260.45,131.48
  Bottom 1.016: RV_1.2 106.78,130.84 108.05,129.57 | 108.05,129.57 108.05,123.22 105.51,120.68 v105.51,119.41 | v105.51,40.67 RV_3.2 | RV_4.2 255.37,38.13 260.45,43.21 v260.45,109.25 | 108.05,129.57 108.05,130.84 109.95,132.75 144.24,132.75 146.15,134.65 146.15,139.73 147.42,141 233.78,141 243.3,131.48 RV_2.2 v260.45,131.48 265.53,131.48 268.49,128.52 268.49,126.13 268.07,125.71 | FROMSENSORSHIELD.10 FROMSENSSHDGHOST.10 268.07,125.71 | 268.07,125.71 266.85,125.71 JP1.1
-LED4  (via drill 1)
  Top 0.254: v144.24,130.84 v153.13,130.84 | v155.04,120.05 v155.04,40.04
  Bottom 1.016: RB2_3.2 RB2_4.2 v155.04,40.04 | RB2_1.2 v144.24,130.84 | v153.13,130.84 RB2_2.2 154.4,130.84 153.13,129.57 153.13,121.95 v155.04,120.05 179.8,120.05 181.07,118.78 192.5,118.78 193.77,120.05 252.83,120.05 254.1,121.32 259.18,121.32 261.08,123.22 JP1.2 266.85,123.17 FROMSENSSHDGHOST.9 FROMSENSORSHIELD.9
-LED5  (via drill 1)
  Top 0.254: v75.03,86.39 v75.03,74.33 | v200.76,88.3 v206.47,88.3
  Bottom 1.016: RB1_1.2 76.3,96.55 77.57,95.28 77.57,87.66 | 77.57,87.66 76.3,86.39 v75.03,86.39 | v75.03,74.33 RB1_3.2 | RB1_4.2 257.91,74.96 257.91,85.12 | 257.91,85.12 257.91,95.28 256.64,96.55 | 256.64,96.55 RB1_2.2 | 77.57,87.66 80.74,84.49 109.95,84.49 114.4,88.93 189.96,88.93 193.14,85.76 197.58,85.76 200.12,88.3 v200.76,88.3 | v206.47,88.3 207.74,88.3 209.65,86.39 252.83,86.39 254.1,85.12 257.91,85.12 | 256.64,96.55 256.64,107.98 264.26,115.6 JP1.5 266.85,115.55 FROMSENSSHDGHOST.6 | FROMSENSSHDGHOST.6 | FROMSENSSHDGHOST.6 FROMSENSORSHIELD.6
-LED6  (via drill 1)
  Top 0.254: v85.19,86.39 v85.19,74.33 | v165.2,63.53 v165.2,98.46 | v258.54,104.81 v250.29,104.81
  Bottom 1.016: RVI_1.2 86.46,107.98 87.73,106.71 87.73,100.36 | 87.73,100.36 85.19,97.82 v85.19,86.39 | v85.19,74.33 RVI_4.2 | RVI_5.2 v165.2,63.53 | v165.2,98.46 165.83,98.46 167.74,100.36 | 167.74,100.36 167.74,106.71 166.47,107.98 RVI_2.2 116.94,107.98 108.05,99.09 89,99.09 87.73,100.36 | 167.74,100.36 169.01,99.09 188.06,99.09 198.22,109.25 200.76,109.25 202.03,107.98 RVI_3.2 254.1,107.98 | RVI_6.2 255.37,60.99 259.18,64.8 259.18,104.17 v258.54,104.81 | 254.1,107.98 257.91,111.79 257.91,116.87 259.18,118.14 JP1.4 266.85,118.09 FROMSENSSHDGHOST.7 | FROMSENSSHDGHOST.7 | FROMSENSSHDGHOST.7 FROMSENSORSHIELD.7 | v250.29,104.81 250.92,104.81 254.1,107.98
CAM_RX
  Bottom 1.016: FROMSENSSHDGHOST.2 FROMSENSORSHIELD.2 277.01,105.39 278.23,104.17 278.23,80.04 277.59,79.41 274.8,79.41 CAM.3
CAM_TX
  Bottom 1.016: FROMSENSSHDGHOST.3 FROMSENSORSHIELD.3 270.55,107.93 265.53,102.9 265.53,92.11 268.07,89.57 268.07,82.58 273.78,76.87 274.26,76.87 CAM.4
GND_12V  (via drill 1)  (9 unrouted)
  Top 0.254: v264.26,90.2 v269.97,90.2
  Bottom 1.016: FROMSENSSHDGHOST.4 FROMSENSORSHIELD.4 270.55,110.47 263.62,103.54 263.62,90.84 v264.26,90.2 | 275.03,90.2 275.03,82.99 CAM.1 | v269.97,90.2 275.03,90.2 | 275.03,90.2 275.02,90.21 274.48,90.74 X1.2
N$12
  Bottom 1.016: ROUGE2_1.A ROUGE2_2.K
N$13
  Bottom 1.016: ROUGE2_2.A ROUGE2_3.K
N$14
  Bottom 1.016: ROUGE2_3.A ROUGE2_4.K
N$15
  Bottom 1.016: ROUGE2_4.A 108.72,114.5 ROUGE2_5.K
N$16
  Bottom 1.016: ROUGE2_5.A ROUGE2_6.K
N$17
  Bottom 1.016: ROUGE2_6.A 133.28,114.5 134.72,113.06 RR2_1.1
N$18
  Bottom 1.016: ROUGE2_7.A ROUGE2_8.K | ROUGE2_8.K
N$19
  Bottom 1.016: ROUGE2_8.A ROUGE2_9.K
N$20
  Bottom 1.016: ROUGE2_9.A 208.72,114.51 ROUGE2_10.K
N$21
  Bottom 1.016: ROUGE2_10.A ROUGE2_11.K
N$22
  Bottom 1.016: ROUGE2_11.A ROUGE2_12.K
N$23
  Bottom 1.016: ROUGE2_12.A 253.93,114.5 255.37,113.06 RR2_2.1
N$24
  Bottom 1.016: ROUGE2_13.A 108.72,91.51 ROUGE2_14.K
N$25
  Bottom 1.016: ROUGE2_14.A ROUGE2_15.K
N$26
  Bottom 1.016: ROUGE2_15.A ROUGE2_16.K
N$27
  Bottom 1.016: ROUGE2_16.A ROUGE2_17.K | ROUGE2_17.K
N$28
  Bottom 1.016: ROUGE2_17.A ROUGE2_18.K
N$29
  Bottom 1.016: ROUGE2_18.A 194.38,91.5 195.68,90.2 RR2_3.1
N$30
  Bottom 1.016: ROUGE2_19.A ROUGE2_20.K
N$31
  Bottom 1.016: ROUGE2_20.A ROUGE2_21.K
N$32
  Bottom 1.016: ROUGE2_21.A ROUGE2_22.K
N$33
  Bottom 1.016: ROUGE2_22.A ROUGE2_23.K
N$34
  Bottom 1.016: ROUGE2_23.A ROUGE2_24.K
N$35
  Bottom 1.016: ROUGE2_24.A 194.52,68.5 195.68,67.34 RR2_4.1
N$36
  Bottom 1.016: ROUGE2_25.A ROUGE2_26.K
N$37
  Bottom 1.016: ROUGE2_26.A ROUGE2_27.K
N$38
  Bottom 1.016: ROUGE2_27.A ROUGE2_28.K
N$39
  Bottom 1.016: ROUGE2_28.A ROUGE2_29.K
N$40
  Bottom 1.016: ROUGE2_29.A ROUGE2_30.K
N$41
  Bottom 1.016: ROUGE2_30.A 133.7,45.5 134.72,44.48 RR2_5.1
N$42
  Bottom 1.016: ROUGE2_31.A ROUGE2_32.K
N$43
  Bottom 1.016: ROUGE2_32.A ROUGE2_33.K
N$44
  Bottom 1.016: ROUGE2_33.A ROUGE2_34.K
N$45
  Bottom 1.016: ROUGE2_34.A ROUGE2_35.K
N$46
  Bottom 1.016: ROUGE2_35.A ROUGE2_36.K
N$47
  Bottom 1.016: ROUGE2_36.A 254.35,45.5 255.37,44.48 RR2_6.1
N$48
  Bottom 1.016: ROUGE1_26.A ROUGE1_27.K
N$49
  Bottom 1.016: ROUGE1_27.A ROUGE1_28.K
N$50
  Bottom 1.016: ROUGE1_28.A 208.73,22.49 ROUGE1_29.K
N$51
  Bottom 1.016: ROUGE1_29.A ROUGE1_30.K
N$52
  Bottom 1.016: ROUGE1_30.A 234.17,22.5 235.05,21.62 RR1_6.1
N$53
  Bottom 1.016: ROUGE1_21.A ROUGE1_22.K
N$54
  Bottom 1.016: ROUGE1_22.A ROUGE1_23.K
N$55
  Bottom 1.016: ROUGE1_23.A ROUGE1_24.K
N$56
  Bottom 1.016: ROUGE1_24.A ROUGE1_25.K
N$57
  Bottom 1.016: ROUGE1_25.A 133.84,22.5 134.72,21.62 RR1_5.1
N$58
  Bottom 1.016: ROUGE1_16.A ROUGE1_17.K
N$59
  Bottom 1.016: ROUGE1_17.A ROUGE1_18.K
N$60
  Bottom 1.016: ROUGE1_18.A ROUGE1_19.K
N$61
  Bottom 1.016: ROUGE1_19.A ROUGE1_20.K
N$62
  Bottom 1.016: ROUGE1_20.A 244.61,80 245.84,78.77 RR1_4.1
N$63
  Bottom 1.016: ROUGE1_11.A 58.48,80 58.52,80.04 58.69,80.04 ROUGE1_12.K
N$64
  Bottom 1.016: ROUGE1_12.A ROUGE1_13.K
N$65
  Bottom 1.016: ROUGE1_13.A ROUGE1_14.K
N$66
  Bottom 1.016: ROUGE1_14.A ROUGE1_15.K
N$67
  Bottom 1.016: ROUGE1_15.A 121.27,84.38 RR1_3.1
N$68
  Bottom 1.016: ROUGE1_6.A ROUGE1_7.K
N$69
  Bottom 1.016: ROUGE1_7.A ROUGE1_8.K
N$70
  Bottom 1.016: ROUGE1_8.A ROUGE1_9.K
N$71
  Bottom 1.016: ROUGE1_9.A ROUGE1_10.K
N$72
  Bottom 1.016: ROUGE1_10.A 233.46,137.5 235.05,135.92 RR1_2.1
N$73
  Bottom 1.016: ROUGE1_1.A ROUGE1_2.K
N$74
  Bottom 1.016: ROUGE1_2.A 88.72,137.51 ROUGE1_3.K
N$75
  Bottom 1.016: ROUGE1_3.A ROUGE1_4.K
N$76
  Bottom 1.016: ROUGE1_4.A ROUGE1_5.K
N$77
  Bottom 1.016: ROUGE1_5.A 133.14,137.5 134.72,135.92 RR1_1.1
N$78
  Bottom 1.016: VERT_10.A 192.18,34 196.95,29.24 204.57,29.24 209.65,34.32 218.41,34.32 VERT_11.K
N$79
  Bottom 1.016: VERT_11.A VERT_12.K
N$80
  Bottom 1.016: VERT_12.A 244.26,34 245.21,33.05 RV_4.1
N$81
  Bottom 1.016: VERT_7.A 58.72,34.01 VERT_8.K
N$82
  Bottom 1.016: VERT_8.A 70.89,33.99 75.66,29.24 85.82,29.24 90.9,34.32 98.41,34.32 VERT_9.K
N$83
  Bottom 1.016: VERT_9.A 103.29,34 105.51,31.78 RV_3.1
N$84
  Bottom 1.016: VERT_4.A 191.63,126 195.68,130.84 204.57,130.84 208.38,125.76 218.49,125.76 VERT_5.K
N$85
  Bottom 1.016: VERT_5.A VERT_6.K
N$86
  Bottom 1.016: VERT_6.A 243.7,126 245.21,124.49 RV_2.1
N$87
  Bottom 1.016: VERT_1.A VERT_2.K
N$88
  Bottom 1.016: VERT_2.A 70.98,126 75.03,130.84 83.92,130.84 87.73,125.76 98.48,125.76 VERT_3.K
N$89
  Bottom 1.016: VERT_3.A 103.99,126 105.51,124.49 RV_1.1
N$90  (via drill 1)
  Top 0.254: v201.39,49.56 v201.39,38.13
  Bottom 1.016: BLEU2_11.K 178.73,58.02 179.8,59.09 182.98,59.09 192.5,49.56 v201.39,49.56 | v201.39,38.13 201.39,34.12 BLEU2_10.A
N$91
  Bottom 1.016: BLEU2_12.K 158.74,38.24 155.04,41.94 147.42,41.94 146.15,43.21 146.15,45.75 147.42,47.02 166.47,47.02 172.82,53.37 179.17,53.37 181.71,55.91 181.71,56.57 BLEU2_11.A
N$92
  Bottom 1.016: RB2_4.1 160.12,30.51 161.39,31.78 161.39,33.89 BLEU2_12.A
N$93  (via drill 1)
  Top 0.254: v94.08,36.86 v94.08,57.18
  Bottom 1.016: BLEU2_7.A 87.4,34 90.27,36.86 v94.08,36.86 | v94.08,57.18 98.55,57.18 BLEU2_8.K
N$94  (via drill 1)
  Top 0.254: v116.3,36.86 v116.3,57.18
  Bottom 1.016: BLEU2_9.K 117.89,34 117.89,35.9 116.94,36.86 v116.3,36.86 | v116.3,57.18 101.46,57.18 BLEU2_8.A
N$95
  Bottom 1.016: BLEU2_9.A 124.88,34 125.83,33.05 RB2_3.1
N$96  (via drill 1)
  Top 0.254: v202.03,111.16 v202.03,121.95
  Bottom 1.016: BLEU2_5.K 178.73,106.91 179.8,107.98 194.41,107.98 197.58,111.16 v202.03,111.16 | v202.03,121.95 202.03,125.25 BLEU2_4.A
N$97  (via drill 1)
  Top 0.254: v181.71,120.68 v181.71,106.71
  Bottom 1.016: BLEU2_6.K 158.73,126.92 160.12,128.3 163.93,128.3 170.28,121.95 181.07,121.95 181.71,121.32 v181.71,120.68 | v181.71,106.71 182.98,106.71 184.25,105.44 184.25,102.9 182.34,101 181.71,101 181.07,101.63 181.07,102.8 BLEU2_5.A
N$98
  Bottom 1.016: RB2_2.1 160.12,123.22 161.39,124.49 161.39,125.88 BLEU2_6.A
N$99  (via drill 1)
  Top 0.254: v97.89,121.95 v97.89,110.52
  Bottom 1.016: BLEU2_1.A 84.94,126.01 87.73,123.22 96.62,123.22 v97.89,121.95 | v97.89,110.52 97.25,110.52 96.62,109.89 96.62,104.17 97.89,102.9 98.63,102.9 BLEU2_2.K
N$100  (via drill 1)
  Top 0.254: v115.67,121.95 v115.67,110.52
  Bottom 1.016: BLEU2_3.K 117.17,126 115.67,124.49 v115.67,121.95 | v115.67,110.52 113.13,110.52 105.51,102.9 101.38,102.9 BLEU2_2.A
N$101
  Bottom 1.016: BLEU2_3.A 123.05,126 124.56,124.49 RB2_1.1
N$102
  Bottom 1.016: BLEU1_10.A BLEU1_11.K
N$103
  Bottom 1.016: BLEU1_11.A BLEU1_12.K
N$104
  Bottom 1.016: BLEU1_12.A 254.21,68.49 255.37,67.34 RB1_4.1
N$105
  Bottom 1.016: BLEU1_7.A BLEU1_8.K
N$106
  Bottom 1.016: BLEU1_8.A BLEU1_9.K
N$107
  Bottom 1.016: BLEU1_9.A 73.87,68.5 75.03,67.34 RB1_3.1
N$108
  Bottom 1.016: BLEU1_4.A BLEU1_5.K
N$109
  Bottom 1.016: BLEU1_5.A BLEU1_6.K
N$110
  Bottom 1.016: BLEU1_6.A 254.07,91.5 255.37,90.2 RB1_2.1
N$111
  Bottom 1.016: BLEU1_1.A BLEU1_2.K
N$112
  Bottom 1.016: BLEU1_2.A BLEU1_3.K
N$113
  Bottom 1.016: BLEU1_3.A 73.73,91.5 75.03,90.2 RB1_1.1
N$114
  Bottom 1.016: VIOLET_16.A VIOLET_17.K
N$115
  Bottom 1.016: VIOLET_17.A VIOLET_18.K
N$116
  Bottom 1.016: VIOLET_18.A 244.12,57 245.21,55.91 RVI_6.1
N$117
  Bottom 1.016: VIOLET_13.A VIOLET_14.K
N$118
  Bottom 1.016: VIOLET_14.A VIOLET_15.K
N$119
  Bottom 1.016: VIOLET_15.A 164.11,57 165.2,55.91 RVI_5.1
N$120
  Bottom 1.016: VIOLET_10.A VIOLET_11.K
N$121
  Bottom 1.016: VIOLET_11.A VIOLET_12.K
N$122
  Bottom 1.016: VIOLET_12.A 84.1,56.99 85.19,55.91 RVI_4.1
N$123
  Bottom 1.016: VIOLET_7.A VIOLET_8.K
N$124
  Bottom 1.016: VIOLET_8.A VIOLET_9.K
N$125
  Bottom 1.016: VIOLET_9.A 243.84,103 245.21,101.63 RVI_3.1
N$126
  Bottom 1.016: VIOLET_4.A 138.72,103 VIOLET_5.K
N$127
  Bottom 1.016: VIOLET_5.A VIOLET_6.K
N$128
  Bottom 1.016: VIOLET_6.A 163.83,103 165.2,101.63 RVI_2.1
N$129
  Bottom 1.016: VIOLET_1.A 58.71,103.01 VIOLET_2.K
N$130
  Bottom 1.016: VIOLET_2.A 78.72,103 VIOLET_3.K
N$131
  Bottom 1.016: VIOLET_3.A 83.8,103.01 85.19,101.63 RVI_1.1